# Altium schematic sheet Schematic.SchDoc: IoT BOARD v1.0
size A3; Engineer: İ. Selçuk ÇINAR; Organization: SELCUK ELECTRONICS; SheetNumber: 1
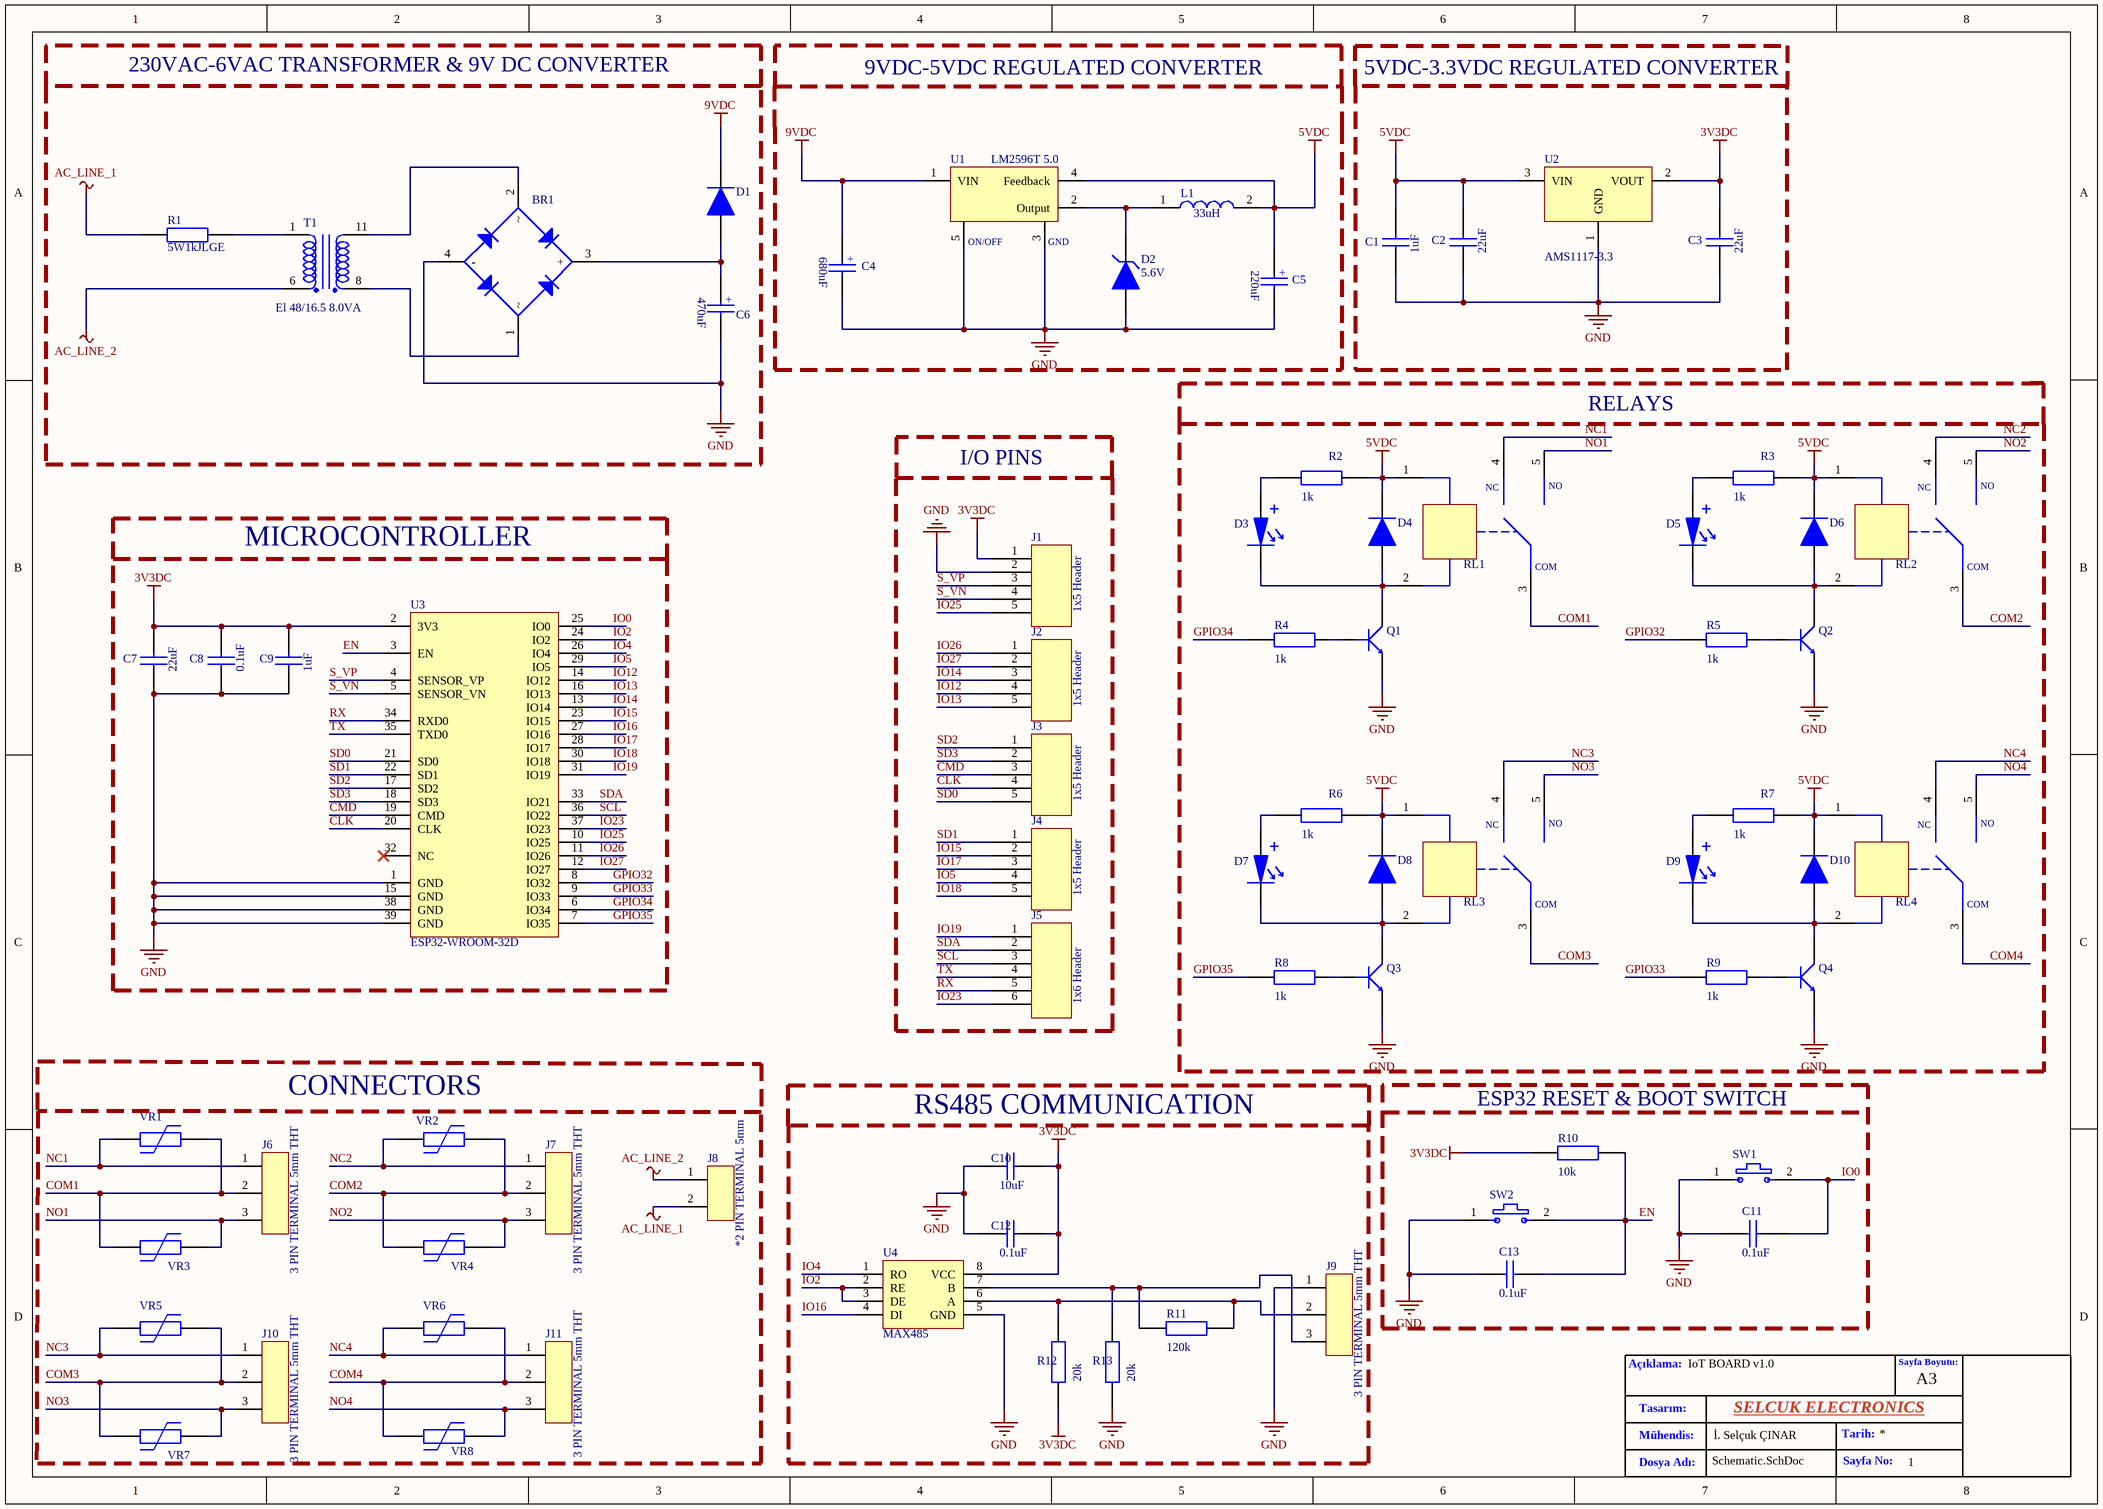
[diagram p0: Schematic.SchDoc]

## Parts
BR1  MB10M  [MB10M]  (value not drawn)
C1  CAP CER 22uF 0805  [CAP CER 1uF 0805]  (value not drawn)
C2  CAP CER 22uF 0805  [CAP CER 22uF 0805]  (value not drawn)
C3  CAP CER 22uF 0805  [CAP CER 22uF 0805]  (value not drawn)
C4  CAP ALU 680uF SMD RADIAL  [CAP ALU 680uF SMD RADIAL]  (value not drawn)
C5  CAP ALU 220uF SMD RADIAL  [CAP ALU 220uF SMD RADIAL]  (value not drawn)
C6  NOBBY  [CAP ALU 470uF THT]  (value not drawn)
C7  CAP CER 22uF 0805  [CAP CER 22uF 0805]  (value not drawn)
C8  CAP CER 0.1uF 0805  [CAP CER 0.1uF 0805]  (value not drawn)
C9  CAP CER 22uF 0805  [CAP CER 1uF 0805]  (value not drawn)
C10  CAP CER 22uF 0805  [CAP CER 10uF 0805]  (value not drawn)
C11  CAP CER 0.1uF 0805  [CAP CER 0.1uF 0805]  (value not drawn)
C12  CAP CER 0.1uF 0805  [CAP CER 0.1uF 0805]  (value not drawn)
C13  CAP CER 0.1uF 0805  [CAP CER 0.1uF 0805]  (value not drawn)
D1  M7-KT 1N4007 SMD  [M7-KT 1N4007 SMD]  (value not drawn)
D2  Working Voltage: 5.6V  [SMB]  (hidden comment: 1SMB5919BT3G)
D3  LED RED THT  [LED RED THT]  (value not drawn)
D4  M7-KT 1N4007 SMD  [M7-KT 1N4007 SMD]  (value not drawn)
D5  LED RED THT  [LED RED THT]  (value not drawn)
D6  M7-KT 1N4007 SMD  [M7-KT 1N4007 SMD]  (value not drawn)
D7  LED RED THT  [LED RED THT]  (value not drawn)
D8  M7-KT 1N4007 SMD  [M7-KT 1N4007 SMD]  (value not drawn)
D9  LED RED THT  [LED RED THT]  (value not drawn)
D10  M7-KT 1N4007 SMD  [M7-KT 1N4007 SMD]  (value not drawn)
J1  1x5 Header  [1x5 Header]
J2  1x5 Header  [1x5 Header]
J3  1x5 Header  [1x5 Header]
J4  1x5 Header  [1x5 Header]
J5  1x6 Header  [1x6 Header]
J6  3 PIN TERMINAL 5mm THT  [3 PIN TERMINAL 5mm THT]
J7  3 PIN TERMINAL 5mm THT  [3 PIN TERMINAL 5mm THT]
J8  *2 PIN TERMINAL 5mm  [2 PIN TERMINAL 5mm THT]
J9  3 PIN TERMINAL 5mm THT  [3 PIN TERMINAL 5mm THT]
J10  3 PIN TERMINAL 5mm THT  [3 PIN TERMINAL 5mm THT]
J11  3 PIN TERMINAL 5mm THT  [3 PIN TERMINAL 5mm THT]
L1  SRR1260-330M  [SRR1260-330M]  (value not drawn)
Q1  BC847 NPN SMD SOT-23  [BC847 NPN SMD SOT-23]  (value not drawn)
Q2  BC847 NPN SMD SOT-23  [BC847 NPN SMD SOT-23]  (value not drawn)
Q3  BC847 NPN SMD SOT-23  [BC847 NPN SMD SOT-23]  (value not drawn)
Q4  BC847 NPN SMD SOT-23  [BC847 NPN SMD SOT-23]  (value not drawn)
R1  5W1kJLGE  [5W1kJLGE]
R2  RES 1K OHM 805  [RES 1K OHM 805]  (value not drawn)
R3  RES 1K OHM 805  [RES 1K OHM 805]  (value not drawn)
R4  RES 1K OHM 805  [RES 1K OHM 805]  (value not drawn)
R5  RES 1K OHM 805  [RES 1K OHM 805]  (value not drawn)
R6  RES 1K OHM 805  [RES 1K OHM 805]  (value not drawn)
R7  RES 1K OHM 805  [RES 1K OHM 805]  (value not drawn)
R8  RES 1K OHM 805  [RES 1K OHM 805]  (value not drawn)
R9  RES 1K OHM 805  [RES 1K OHM 805]  (value not drawn)
R10  RES 10K OHM 805  [RES 10K OHM 805]  (value not drawn)
R11  RES 120R OHM 805  [RES 120R OHM 805]  (value not drawn)
R12  RES 20K OHM 805  [RES 20K OHM 805]  (value not drawn)
R13  RES 20K OHM 805  [RES 20K OHM 805]  (value not drawn)
RL1  SRD-03VDC-SL-C  [SRD-03VDC-SL-C]  (value not drawn)
RL2  SRD-03VDC-SL-C  [SRD-03VDC-SL-C]  (value not drawn)
RL3  SRD-03VDC-SL-C  [SRD-03VDC-SL-C]  (value not drawn)
RL4  SRD-03VDC-SL-C  [SRD-03VDC-SL-C]  (value not drawn)
SW1  SKRKAEE010  [SKRKAEE010]  (value not drawn)
SW2  SKRKAEE010  [SKRKAEE010]  (value not drawn)
T1  El 48/16.5 8.0VA  [El 48/16.5 8.0VA]
U1  LM2596T 5.0  [LM2596T 5.0]
U2  AMS1117-3.3  [AMS1117-3.3]
U3  ESP32-WROOM-32D  [ESP32-WROOM-32D]
U4  MAX485  [MAX485]
VR1  B72210S0151K101  [B72210S0151K101]  (value not drawn)
VR2  B72210S0151K101  [B72210S0151K101]  (value not drawn)
VR3  B72210S0151K101  [B72210S0151K101]  (value not drawn)
VR4  B72210S0151K101  [B72210S0151K101]  (value not drawn)
VR5  B72210S0151K101  [B72210S0151K101]  (value not drawn)
VR6  B72210S0151K101  [B72210S0151K101]  (value not drawn)
VR7  B72210S0151K101  [B72210S0151K101]  (value not drawn)
VR8  B72210S0151K101  [B72210S0151K101]  (value not drawn)

## Blocks framed on the sheet
230VAC-6VAC TRANSFORMER & 9V DC CONVERTER: BR1 C6 D1 R1 T1
RELAYS: D3-D10 Q1-Q4 R2-R9 RL1-RL4
MICROCONTROLLER: C7-C9 U3
ESP32 RESET & BOOT SWITCH: C11 C13 R10 SW1 SW2
CONNECTORS: J6-J8 J10 J11 VR1-VR8
RS485 COMMUNICATION: C10 C12 J9 R11-R13 U4

## Nets
3V3DC: C3.2 C7.2 C8.2 C9.2 C10.2 C12.2 J1.1 R10.1 R12.1 U2.2(VOUT) U3.2(3V3) U4.8(VCC)
5VDC: C1.2 C2.2 C5.1 D4.2 D6.2 D8.2 D10.2 L1.2 R2.2 R3.2 R6.2 R7.2 RL1.1(+) RL2.1(+) RL3.1(+) RL4.1(+) U1.4(Feedback) U2.3(VIN)
9VDC: C4.1 D1.2 U1.1(VIN)
AC_LINE_1: J8.2 R1.1
AC_LINE_2: J8.1 T1.6
GND: BR1.4(-) C1.1 C2.1 C3.1 C4.2 C5.2 C6.2 C7.1 C8.1 C9.1 C10.1 C11.1 C12.1 C13.1 D2.A J1.2 J9.1 Q1.2(E) Q2.2(E) Q3.2(E) Q4.2(E) R13.1 SW1.1 SW2.1 U1.3(GND) U1.5(ON/OFF) U2.1(GND) U3.1(GND) U3.15(GND) U3.38(GND) U3.39(GND) U4.5(GND)
CLK: J3.4 U3.20(CLK)
CMD: J3.3 U3.19(CMD)
COM1: J6.2 RL1.3(COM) VR1.2 VR3.1
COM2: J7.2 RL2.3(COM) VR2.2 VR4.1
COM3: J10.2 RL3.3(COM) VR5.2 VR7.1
COM4: J11.2 RL4.3(COM) VR6.2 VR8.1
EN: C13.2 R10.2 SW2.2 U3.3(EN)
GPIO32: R5.1 U3.8(IO32)
GPIO33: R9.1 U3.9(IO33)
GPIO34: R4.1 U3.6(IO34)
GPIO35: R8.1 U3.7(IO35)
IO0: C11.2 SW1.2 U3.25(IO0)
IO2: U3.24(IO2) U4.2(RE) U4.3(DE)
IO4: U3.26(IO4) U4.1(RO)
IO5: J4.4 U3.29(IO5)
IO12: J2.4 U3.14(IO12)
IO13: J2.5 U3.16(IO13)
IO14: J2.3 U3.13(IO14)
IO15: J4.2 U3.23(IO15)
IO16: U3.27(IO16) U4.4(DI)
IO17: J4.3 U3.28(IO17)
IO18: J4.5 U3.30(IO18)
IO19: J5.1 U3.31(IO19)
IO23: J5.6 U3.37(IO23)
IO25: J1.5 U3.10(IO25)
IO26: J2.1 U3.11(IO26)
IO27: J2.2 U3.12(IO27)
NC1: J6.1 RL1.4(NC) VR1.1
NC2: J7.1 RL2.4(NC) VR2.1
NC3: J10.1 RL3.4(NC) VR5.1
NC4: J11.1 RL4.4(NC) VR6.1
NO1: J6.3 RL1.5(NO) VR3.2
NO2: J7.3 RL2.5(NO) VR4.2
NO3: J10.3 RL3.5(NO) VR7.2
NO4: J11.3 RL4.5(NO) VR8.2
RX: J5.5 U3.34(RXD0)
S_VN: J1.4 U3.5(SENSOR_VN)
S_VP: J1.3 U3.4(SENSOR_VP)
SCL: J5.3 U3.36(IO22)
SD0: J3.5 U3.21(SD0)
SD1: J4.1 U3.22(SD1)
SD2: J3.1 U3.17(SD2)
SD3: J3.2 U3.18(SD3)
SDA: J5.2 U3.33(IO21)
TX: J5.4 U3.35(TXD0)
NetBR1_1: BR1.1 T1.8
NetBR1_2: BR1.2 T1.11
NetBR1_3: BR1.3(+) C6.1 D1.1
NetD2_C: D2.C L1.1 U1.2(Output)
NetD3_1: D3.1 R2.1
NetD3_2: D3.2 D4.1 Q1.3(C) RL1.2(-)
NetD5_1: D5.1 R3.1
NetD5_2: D5.2 D6.1 Q2.3(C) RL2.2(-)
NetD7_1: D7.1 R6.1
NetD7_2: D7.2 D8.1 Q3.3(C) RL3.2(-)
NetD9_1: D9.1 R7.1
NetD9_2: D9.2 D10.1 Q4.3(C) RL4.2(-)
NetJ9_2: J9.2 R11.2 R12.2 U4.6(A)
NetJ9_3: J9.3 R11.1 R13.2 U4.7(B)
NetQ1_1: Q1.1(B) R4.2
NetQ2_1: Q2.1(B) R5.2
NetQ3_1: Q3.1(B) R8.2
NetQ4_1: Q4.1(B) R9.2
NetR1_2: R1.2 T1.1

Not connected (* = marked no-connect by the designer): U3 32(NC)*

## Notes on the sheet
- 9VDC-5VDC REGULATED CONVERTER
- 5VDC-3.3VDC REGULATED CONVERTER
- I/O PINS
- Açıklama:
- Sayfa Boyutu:
- A3
- Mühendis:
- Tasarım:
- Tarih:
- Sayfa No:
- Dosya Adı:
- (in symbol CAP ALU 220uF SMD RADIAL) 220uF; +
- (in symbol CAP ALU 470uF THT) 470uF; +
- (in symbol CAP ALU 680uF SMD RADIAL) 680uF; +
- (in symbol CAP CER 0.1uF 0805) 0.1uF
- (in symbol CAP CER 1uF 0805) 1uF
- (in symbol CAP CER 10uF 0805) 10uF
- (in symbol CAP CER 22uF 0805) 22uF
- (in symbol RES 1K OHM 805) 1k
- (in symbol RES 10K OHM 805) 10k
- (in symbol RES 20K OHM 805) 20k
- (in symbol RES 120R OHM 805) 120k
- (in symbol SRR1260-330M) 33uH

## Library data of the parts
BR1 = MB10M: Bridge Diode AC-DC
C1 C9 = CAP CER 1uF 0805: 1uF 16V 10% x5R 805 SMD Capacitor
C2 C3 C7 = CAP CER 22uF 0805: 22uF 16V 10% x5R 805 SMD Capacitor
C4 = CAP ALU 680uF SMD RADIAL: CAP ALU 680uF SMD
C5 = CAP ALU 220uF SMD RADIAL: CAP ALU 220uF SMD
C6 = CAP ALU 470uF THT: CAP ALU 470uF Normal
C8 C11-C13 = CAP CER 0.1uF 0805: 0.1uF 16V 10% x5R 805 SMD Capacitor
C10 = CAP CER 10uF 0805: 10uF 16V 10% x5R 805 SMD Capacitor
D1 D4 D6 D8 D10 = M7-KT 1N4007 SMD: M7-KT - 1N4007 - SMD Diyot 1A 1000V
D2 = 1SMB5919BT3G: Diode Zener Single 5.6V 5% 3W 2-Pin SMB T/R; Manufacturer: ON Semiconductor; Designed by: BERK; Material: Plastic; Max Reverse Leakage Current: 5uA; Impedance: 2R; Forward Voltage: 1.5V; Power Dissipation: 550mW; Zener Current: 267mA; Test Current: 66.9mA; Breakdown Voltage: 5.88V; ESD Protection: Yes; Supplier 1: Digi-Key; Manufacturer Part Number: 1SMB5919BT3G; RoHS: Yes; Category: Zener Diodes; Pricing 1: 1=0,45000, 10=0,31900, 100=0,16110, 500=0,14274, 1000=0,11109 (USD); Case/Package: SMB; Number of Pins: 2; Contact Plating: Tin,Matte; Min Operating Temperature: -65°C; Max Operating Temperature: 150°C; Package Quantity: 1; Packaging: Tape and Reel; Max Power Dissipation: 3W; Tolerance: 5%; Voltage Tolerance: 5%; Zener Voltage: 5.6V; Element Configuration: Single; Voltage Rating (DC): 5.6V; Power Rating: 3W; Length: 4.32mm; Width: 3.56mm; Height: 2.13mm; Radiation Hardening: No; Lead Free: Lead Free; Halogen Free: Halogen Free; REACH SVHC: No SVHC; ComponentLink1URL: https://datasheet.ciiva.com/27747/1308331-27747654.pdf?src-supplier=Jameco; ComponentLink1Description: https://datasheet.ciiva.com/27747/1308331-27747654.pdf?src-supplier=Jameco; ComponentLink2URL: https://datasheet.ciiva.com/1182/1smb5913bt3-d-1182657.pdf?src-supplier=Element14; ComponentLink2Description: https://datasheet.ciiva.com/1182/1smb5913bt3-d-1182657.pdf?src-supplier=Element14; ComponentLink3URL: https://datasheet.ciiva.com/1182/1smb5913bt3-d-1182658.pdf?src-supplier=Element14; ComponentLink3Description: https://datasheet.ciiva.com/1182/1smb5913bt3-d-1182658.pdf?src-supplier=Element14; ComponentLink4URL: https://datasheet.ciiva.com/895/1smb5913bt3-d-895203.pdf?src-supplier=Digi-Key; ComponentLink4Description: https://datasheet.ciiva.com/895/1smb5913bt3-d-895203.pdf?src-supplier=Digi-Key; ComponentLink5URL: https://datasheet.ciiva.com/895/1smb5913bt3-d-895204.pdf?src-supplier=Digi-Key; ComponentLink5Description: https://datasheet.ciiva.com/895/1smb5913bt3-d-895204.pdf?src-supplier=Digi-Key; ComponentLink6URL: https://datasheet.ciiva.com/895/1smb5913bt3-d-895205.pdf?src-supplier=Digi-Key; ComponentLink6Description: https://datasheet.ciiva.com/895/1smb5913bt3-d-895205.pdf?src-supplier=Digi-Key; ComponentLink7URL: https://datasheet.ciiva.com/15198/getdatasheetpartid-311040-15198695.pdf?src-supplier=Verical; ComponentLink7Description: https://datasheet.ciiva.com/15198/getdatasheetpartid-311040-15198695.pdf?src-supplier=Verical; ComponentLink8URL: https://datasheet.ciiva.com/16311/1smb5913bt3-d-16311847.pdf?src-supplier=Future+Electronics; ComponentLink8Description: https://datasheet.ciiva.com/16311/1smb5913bt3-d-16311847.pdf?src-supplier=Future+Electronics; ComponentLink9URL: https://datasheet.ciiva.com/16472/1smb5913bt3-d-16472779.pdf?src-supplier=Avnet+Asia; ComponentLink9Description: https://datasheet.ciiva.com/16472/1smb5913bt3-d-16472779.pdf?src-supplier=Avnet+Asia; Max Reverse Current: 5uA; Supplier Part Number 1: 1SMB5919BT3GOSCT-ND
D3 D5 D7 D9 = LED RED THT: Throught LED
J6 J7 J9-J11 = 3 PIN TERMINAL 5mm THT: 3 Position Wire to Board Terminal Block Horizontal with Board 0.197" (5.00mm) Through Hole
J8 = 2 PIN TERMINAL 5mm THT: 2 Position Wire to Board Terminal Block Horizontal with Board 0.197" (5.00mm) Through Hole
L1 = SRR1260-330M: 33 µH Shielded Drum Core, Wirewound Inductor 3 A 60mOhm Max Nonstandard
Q1-Q4 = BC847 NPN SMD SOT-23: BC847 Transistör NPN SMD SOT-23100mA, 45V
R1 = 5W1kJLGE: Resistor 5 Watt Cermet Wirewound Flameproof 1KOhm 5% Axial Lead
R2-R9 = RES 1K OHM 805: 1K 805 1/8 SMD Direnç
R10 = RES 10K OHM 805: 10K 805 1/8 SMD Direnç
R11 = RES 120R OHM 805: 120Ohm 805 1/8 SMD Direnç
R12 R13 = RES 20K OHM 805: 20K 805 1/8 SMD Direnç
RL1-RL4 = SRD-03VDC-SL-C: Relays General Purpose Non Latching 3VDC SPDT 10A (250VAC) Max 5PIN
SW1 SW2 = SKRKAEE010: Switch Tactile N.O. SPST Round Button Gull Wing 0.05A 12VDC 1.57N SMD T/R
T1 = El 48/16.5 8.0VA: 230VAC-6VAC Transformer 8VA
U1 = LM2596T 5.0: SIMPLE SWITCHER&reg; 4.5V to 40V, 3A Low Component Count Step-Down Regulator 5-TO-220
U2 = AMS1117-3.3: Sot223/Pkg 1-Amp 3.3-Volt Low Drop Out Voltage Regulatator
U3 = ESP32-WROOM-32D: SMD MODULE, ESP32-D0WDQ6, 32MBIT
U4 = MAX485: 1/1 Transceiver Half RS422, RS485 8-uMAX-EP|8-uSOP-EP
VR1-VR8 = B72210S0151K101: 240 V 2.5 kA Varistor 1 Circuit Through Hole Disc 10mm